# EAGLE schematic Stepper_2_0 (EAGLE 8.0.0)
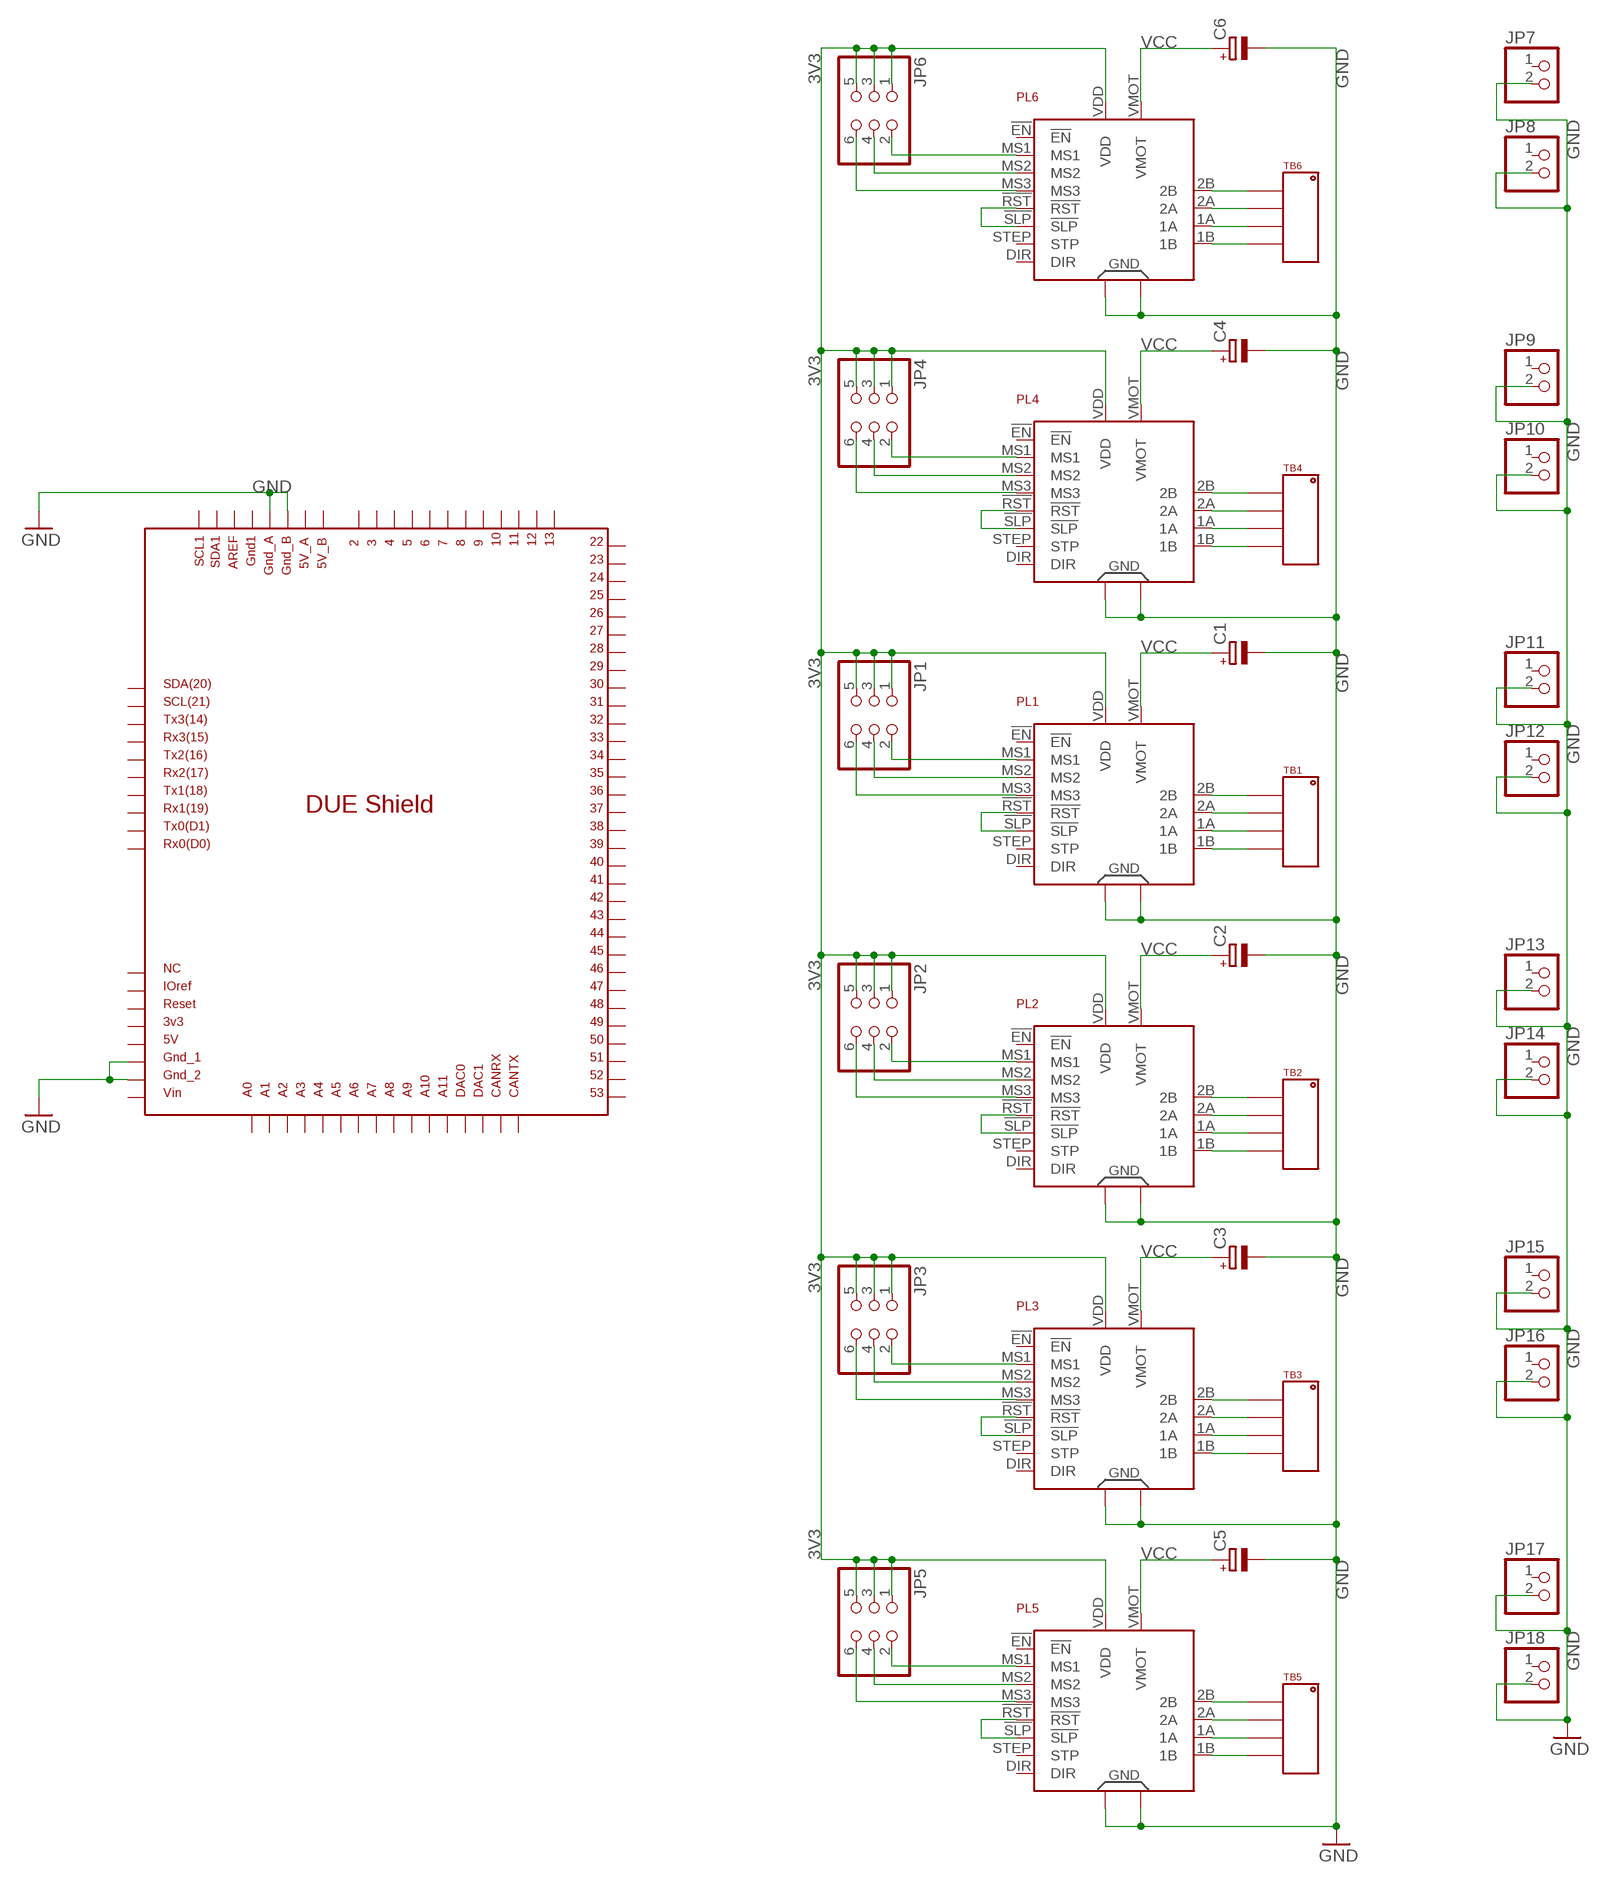
[diagram p0: schematic, sheet 1]

## Parts
C1  CPOL-EUETR2  [ETR2]
C2  CPOL-EUETR2  [ETR2]
C3  CPOL-EUETR2  [ETR2]
C4  CPOL-EUETR2  [ETR2]
C5  CPOL-EUETR2  [ETR2]
C6  CPOL-EUETR2  [ETR2]
JP1  PINHD-2X3  [2X03]
JP2  PINHD-2X3  [2X03]
JP3  PINHD-2X3  [2X03]
JP4  PINHD-2X3  [2X03]
JP5  PINHD-2X3  [2X03]
JP6  PINHD-2X3  [2X03]
JP7  PINHD-1X2  [1X02]
JP8  PINHD-1X2  [1X02]
JP9  PINHD-1X2  [1X02]
JP10  PINHD-1X2  [1X02]
JP11  PINHD-1X2  [1X02]
JP12  PINHD-1X2  [1X02]
JP13  PINHD-1X2  [1X02]
JP14  PINHD-1X2  [1X02]
JP15  PINHD-1X2  [1X02]
JP16  PINHD-1X2  [1X02]
JP17  PINHD-1X2  [1X02]
JP18  PINHD-1X2  [1X02]
PL1  A4988X  [MD09X]
PL2  A4988X  [MD09X]
PL3  A4988X  [MD09X]
PL4  A4988X  [MD09X]
PL5  A4988X  [MD09X]
PL6  A4988X  [MD09X]
TB1  TB_HEAD_3.5MM_01X04  [TB_HEAD_3.5MM_01X04]
TB2  TB_HEAD_3.5MM_01X04  [TB_HEAD_3.5MM_01X04]
TB3  TB_HEAD_3.5MM_01X04  [TB_HEAD_3.5MM_01X04]
TB4  TB_HEAD_3.5MM_01X04  [TB_HEAD_3.5MM_01X04]
TB5  TB_HEAD_3.5MM_01X04  [TB_HEAD_3.5MM_01X04]
TB6  TB_HEAD_3.5MM_01X04  [TB_HEAD_3.5MM_01X04]
U$1  DUE(NOSPI)  [DUE(NOSPI)]

## Nets
3V3: JP1.1 JP1.3 JP1.5 JP2.1 JP2.3 JP2.5 JP3.1 JP3.3 JP3.5 JP4.1 JP4.3 JP4.5 JP5.1 JP5.3 JP5.5 JP6.1 JP6.3 JP6.5 PL1.VDD PL2.VDD PL3.VDD PL4.VDD PL5.VDD PL6.VDD
GND: C1.- C2.- C3.- C4.- C5.- C6.- JP7.2 JP8.2 JP9.2 JP10.2 JP11.2 JP12.2 JP13.2 JP14.2 JP15.2 JP16.2 JP17.2 JP18.2 PL1.GND1 PL1.GND2 PL2.GND1 PL2.GND2 PL3.GND1 PL3.GND2 PL4.GND1 PL4.GND2 PL5.GND1 PL5.GND2 PL6.GND1 PL6.GND2 U$1.GND_1 U$1.GND_2 U$1.GND_A U$1.GND_B
N$1: PL1.1B TB1.P$4
N$2: PL1.1A TB1.P$3
N$3: PL1.2A TB1.P$2
N$4: PL1.2B TB1.P$1
N$5: JP1.6 PL1.MS3
N$6: JP1.4 PL1.MS2
N$7: JP1.2 PL1.MS1
N$11: PL1.!RST PL1.!SLP
N$13: PL2.1B TB2.P$4
N$14: PL2.1A TB2.P$3
N$15: PL2.2A TB2.P$2
N$16: PL2.2B TB2.P$1
N$18: PL2.!RST PL2.!SLP
N$20: JP2.6 PL2.MS3
N$21: JP2.4 PL2.MS2
N$22: JP2.2 PL2.MS1
N$24: PL3.1B TB3.P$4
N$25: PL3.1A TB3.P$3
N$26: PL3.2A TB3.P$2
N$27: PL3.2B TB3.P$1
N$29: PL3.!RST PL3.!SLP
N$31: JP3.6 PL3.MS3
N$32: JP3.4 PL3.MS2
N$33: JP3.2 PL3.MS1
N$35: PL4.1B TB4.P$4
N$36: PL4.1A TB4.P$3
N$37: PL4.2A TB4.P$2
N$38: PL4.2B TB4.P$1
N$40: PL4.!RST PL4.!SLP
N$42: JP4.6 PL4.MS3
N$43: JP4.4 PL4.MS2
N$44: JP4.2 PL4.MS1
N$46: PL5.1B TB5.P$4
N$47: PL5.1A TB5.P$3
N$48: PL5.2A TB5.P$2
N$49: PL5.2B TB5.P$1
N$51: PL5.!RST PL5.!SLP
N$53: JP5.6 PL5.MS3
N$54: JP5.4 PL5.MS2
N$55: JP5.2 PL5.MS1
N$57: PL6.1B TB6.P$4
N$58: PL6.1A TB6.P$3
N$59: PL6.2A TB6.P$2
N$60: PL6.2B TB6.P$1
N$62: PL6.!RST PL6.!SLP
N$64: JP6.6 PL6.MS3
N$65: JP6.4 PL6.MS2
N$66: JP6.2 PL6.MS1
VCC: C1.+ C2.+ C3.+ C4.+ C5.+ C6.+ PL1.VMOT PL2.VMOT PL3.VMOT PL4.VMOT PL5.VMOT PL6.VMOT
Unconnected: JP7.1 JP8.1 JP9.1 JP10.1 JP11.1 JP12.1 JP13.1 JP14.1 JP15.1 JP16.1 JP17.1 JP18.1 PL1.!EN PL1.DIR PL1.STEP(STP) PL2.!EN PL2.DIR PL2.STEP(STP) PL3.!EN PL3.DIR PL3.STEP(STP) PL4.!EN PL4.DIR PL4.STEP(STP) PL5.!EN PL5.DIR PL5.STEP(STP) PL6.!EN PL6.DIR PL6.STEP(STP) U$1.2 U$1.3 U$1.3V3 U$1.4 U$1.5 U$1.5V U$1.5V_A U$1.5V_B U$1.6 U$1.7 U$1.8 U$1.9 U$1.10 U$1.11 U$1.12 U$1.13 U$1.22 U$1.23 U$1.24 U$1.25 U$1.26 U$1.27 U$1.28 U$1.29 U$1.30 U$1.31 U$1.32 U$1.33 U$1.34 U$1.35 U$1.36 U$1.37 U$1.38 U$1.39 U$1.40 U$1.41 U$1.42 U$1.43 U$1.44 U$1.45 U$1.46 U$1.47 U$1.48 U$1.49 U$1.50 U$1.51 U$1.52 U$1.53 U$1.A0 U$1.A1 U$1.A2 U$1.A3 U$1.A4 U$1.A5 U$1.A6 U$1.A7 U$1.A8 U$1.A9 U$1.A10 U$1.A11 U$1.AREF U$1.CANRX U$1.CANTX U$1.DAC0 U$1.DAC1 U$1.GND1 U$1.IOREF U$1.NC U$1.RESET U$1.RX0 U$1.RX1 U$1.RX2 U$1.RX3 U$1.SCL U$1.SCL1 U$1.SDA U$1.SDA1 U$1.TX0 U$1.TX1 U$1.TX2 U$1.TX3 U$1.VIN

## Library data of the parts
C1-C6 = rcl:CPOL-EU: POLARIZED CAPACITOR, European symbol
JP1-JP6 = pinhead:PINHD-2X3: PIN HEADER
JP7-JP18 = pinhead:PINHD-1X2: PIN HEADER
PL1-PL6 = Steppers:A4988X
TB1-TB6 = Steppers:TB_HEAD_3.5MM_01X04
U$1 = JoshParts:DUE(NOSPI)